# EAGLE design RPI-CM4-Breakout (EAGLE 9.6.2)

## Sheet 1 of 4
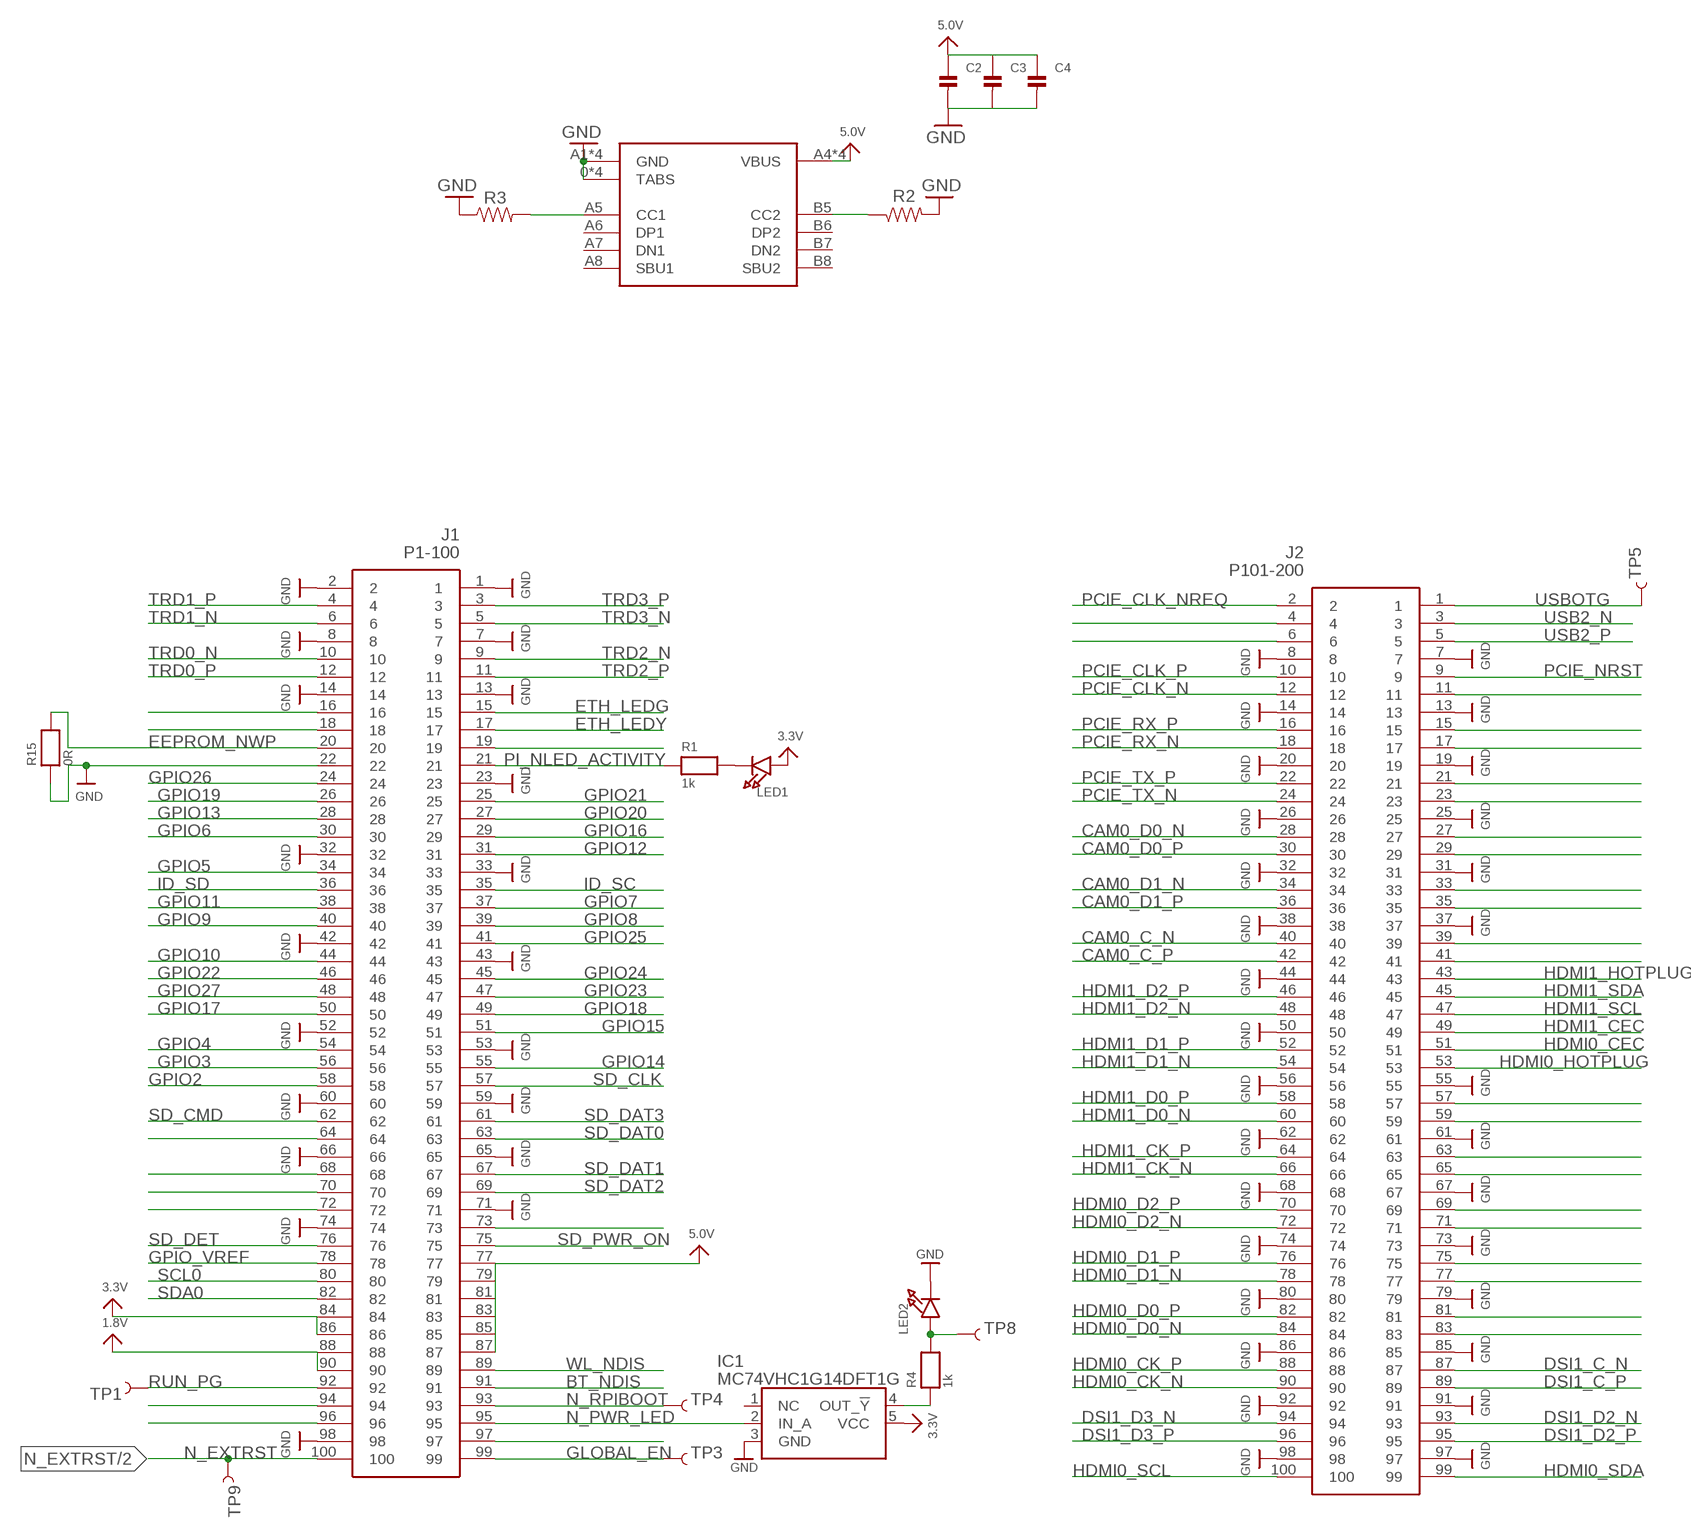
[diagram p0: schematic, sheet 1]

### Parts
C2  CAP_CERAMIC0402  [0402]
C3  CAP_CERAMIC0402  [0402]
C4  CAP_CERAMIC0402  [0402]
IC1  MC74VHC1G14DFT1G  [SOT65P210X110-5N]
J1  P1-100  DF40C-100DS-0.4V_51_  [DF40C100DS04V51]
J2  P101-200  DF40C-100DS-0.4V_51_  [DF40C100DS04V51]
LED1  LED0603  [CHIPLED_0603]
LED2  LED0603  [CHIPLED_0603]
R1  1k  RESISTOR_0402MP  [_0402MP]
R2  RESISTOR0603  [0603]
R3  RESISTOR0603  [0603]
R4  1k  RESISTOR_0402MP  [_0402MP]
R15  0R  RESISTOR_0402MP  [_0402MP]
TP1  TEST-POINT3X5  [PAD.03X.05]
TP3  TEST-POINT3X5  [PAD.03X.05]
TP4  TEST-POINT3X5  [PAD.03X.05]
TP5  TEST-POINT3X5  [PAD.03X.05]
TP8  TEST-POINT3X5  [PAD.03X.05]
TP9  TEST-POINT3X5  [PAD.03X.05]
U$59  TYPE-C-31-M-12  [USB-TYPE-C_16PIN-MALE-TYPE-C-31-M-12]

### Nets
1.8V [VCC]: J1.88 J1.90
3.3V [VCC]: IC1.5(VCC) J1.84 J1.86 LED1.A ; also sheet 2,3,4
5.0V [VCC]: C2.1 C3.1 C4.1 J1.77 J1.79 J1.81 J1.83 J1.85 J1.87 U$59.A4(VBUS) U$59.A9(VBUS) U$59.B4(VBUS) U$59.B9(VBUS) ; also sheet 2,4
A0/CC2: R3.2 U$59.A5(CC1)
A3/CC1: R2.1 U$59.B5(CC2)
BT_NDIS: J1.91
CAM0_C_N: J2.40
CAM0_C_P: J2.42
CAM0_D0_N: J2.28
CAM0_D0_P: J2.30
CAM0_D1_N: J2.34
CAM0_D1_P: J2.36
DSI1_C_N: J2.87
DSI1_C_P: J2.89
DSI1_D2_N: J2.93
DSI1_D2_P: J2.95
DSI1_D3_N: J2.94
DSI1_D3_P: J2.96
EEPROM_NWP: J1.20 R15.2
ETH_LEDG: J1.15 ; also sheet 3
ETH_LEDY: J1.17 ; also sheet 3
GLOBAL_EN: J1.99 TP3.P$1
GND [GND]: C2.2 C3.2 C4.2 IC1.3(GND) J1.1 J1.2 J1.7 J1.8 J1.13 J1.14 J1.22 J1.23 J1.32 J1.33 J1.42 J1.43 J1.52 J1.53 J1.59 J1.60 J1.65 J1.66 J1.71 J1.74 J1.98 J2.7 J2.8 J2.13 J2.14 J2.19 J2.20 J2.25 J2.26 J2.31 J2.32 J2.37 J2.38 J2.44 J2.50 J2.55 J2.56 J2.61 J2.62 J2.67 J2.68 J2.73 J2.74 J2.79 J2.80 J2.85 J2.86 J2.91 J2.92 J2.97 J2.98 LED2.C R2.2 R3.1 R15.1 U$59.0(TABS) U$59.0-1(TABS) U$59.0-2(TABS) U$59.0-3(TABS) U$59.A1(GND) U$59.A12(GND) U$59.B1(GND) U$59.B12(GND) ; also sheet 2,3,4
GPIO2: J1.58
GPIO3: J1.56
GPIO4: J1.54
GPIO5: J1.34
GPIO6: J1.30
GPIO7: J1.37
GPIO8: J1.39
GPIO9: J1.40
GPIO10: J1.44
GPIO11: J1.38
GPIO12: J1.31
GPIO13: J1.28
GPIO14: J1.55
GPIO15: J1.51
GPIO16: J1.29
GPIO17: J1.50
GPIO18: J1.49
GPIO19: J1.26
GPIO20: J1.27
GPIO21: J1.25
GPIO22: J1.46
GPIO23: J1.47
GPIO24: J1.45
GPIO25: J1.41
GPIO26: J1.24
GPIO27: J1.48
GPIO_VREF: J1.78
HDMI0_CEC: J2.51
HDMI0_CK_N: J2.90 ; also sheet 4
HDMI0_CK_P: J2.88 ; also sheet 4
HDMI0_D0_N: J2.84 ; also sheet 4
HDMI0_D0_P: J2.82 ; also sheet 4
HDMI0_D1_N: J2.78 ; also sheet 4
HDMI0_D1_P: J2.76 ; also sheet 4
HDMI0_D2_N: J2.72 ; also sheet 4
HDMI0_D2_P: J2.70 ; also sheet 4
HDMI0_HOTPLUG: J2.53 ; also sheet 4
HDMI0_SCL: J2.100 ; also sheet 4
HDMI0_SDA: J2.99 ; also sheet 4
HDMI1_CEC: J2.49
HDMI1_CK_N: J2.66
HDMI1_CK_P: J2.64
HDMI1_D0_N: J2.60
HDMI1_D0_P: J2.58
HDMI1_D1_N: J2.54
HDMI1_D1_P: J2.52
HDMI1_D2_N: J2.48
HDMI1_D2_P: J2.46
HDMI1_HOTPLUG: J2.43
HDMI1_SCL: J2.47
HDMI1_SDA: J2.45
ID_SC: J1.35
ID_SD: J1.36
N$1: LED1.C R1.2
N$4: IC1.4(OUT_!Y) R4.1
N$5: J2.4
N$6: LED2.A R4.2 TP8.P$1
N$7: J2.6
N$12: J2.11
N$16: J1.16
N$17: J2.15
N$18: J1.18
N$19: J1.19
N$21: J2.17
N$32: J2.21
N$42: J2.23
N$57: J2.27
N$59: J2.29
N$63: J2.33
N$64: J1.64
N$66: J2.35
N$68: J1.68
N$70: J1.70
N$72: J1.72
N$73: J1.73
N$74: J2.39
N$76: J2.41
N$94: J1.94
N$96: J1.96
N$97: J1.97
N$99: J2.57
N$101: J2.59
N$105: J2.63
N$107: J2.65
N$111: J2.69
N$113: J2.71
N$117: J2.75
N$119: J2.77
N$123: J2.81
N$125: J2.83
N_EXTRST: J1.100 TP9.P$1 ; also sheet 2
N_PWR_LED: IC1.2(IN_A) J1.95
N_RPIBOOT: J1.93 TP4.P$1
PCIE_CLK_N: J2.12
PCIE_CLK_NREQ: J2.2
PCIE_CLK_P: J2.10
PCIE_NRST: J2.9
PCIE_RX_N: J2.18
PCIE_RX_P: J2.16
PCIE_TX_N: J2.24
PCIE_TX_P: J2.22
PI_NLED_ACTIVITY: J1.21 R1.1
RUN_PG: J1.92 TP1.P$1
SCL0: J1.80
SD_CLK: J1.57 ; also sheet 4
SD_CMD: J1.62 ; also sheet 4
SD_DAT0: J1.63 ; also sheet 4
SD_DAT1: J1.67 ; also sheet 4
SD_DAT2: J1.69 ; also sheet 4
SD_DAT3: J1.61 ; also sheet 4
SD_DET: J1.76
SD_PWR_ON: J1.75
SDA0: J1.82
TRD0_N: J1.10 ; also sheet 3
TRD0_P: J1.12 ; also sheet 3
TRD1_N: J1.6 ; also sheet 3
TRD1_P: J1.4 ; also sheet 3
TRD2_N: J1.9 ; also sheet 3
TRD2_P: J1.11 ; also sheet 3
TRD3_N: J1.5 ; also sheet 3
TRD3_P: J1.3 ; also sheet 3
USB2_N: J2.3 ; also sheet 2
USB2_P: J2.5 ; also sheet 2
USBOTG: J2.1 TP5.P$1 ; also sheet 2
WL_NDIS: J1.89
Unconnected: IC1.1(NC) U$59.A6(DP1) U$59.A7(DN1) U$59.A8(SBU1) U$59.B6(DP2) U$59.B7(DN2) U$59.B8(SBU2)

## Sheet 2 of 4: USB Connectors
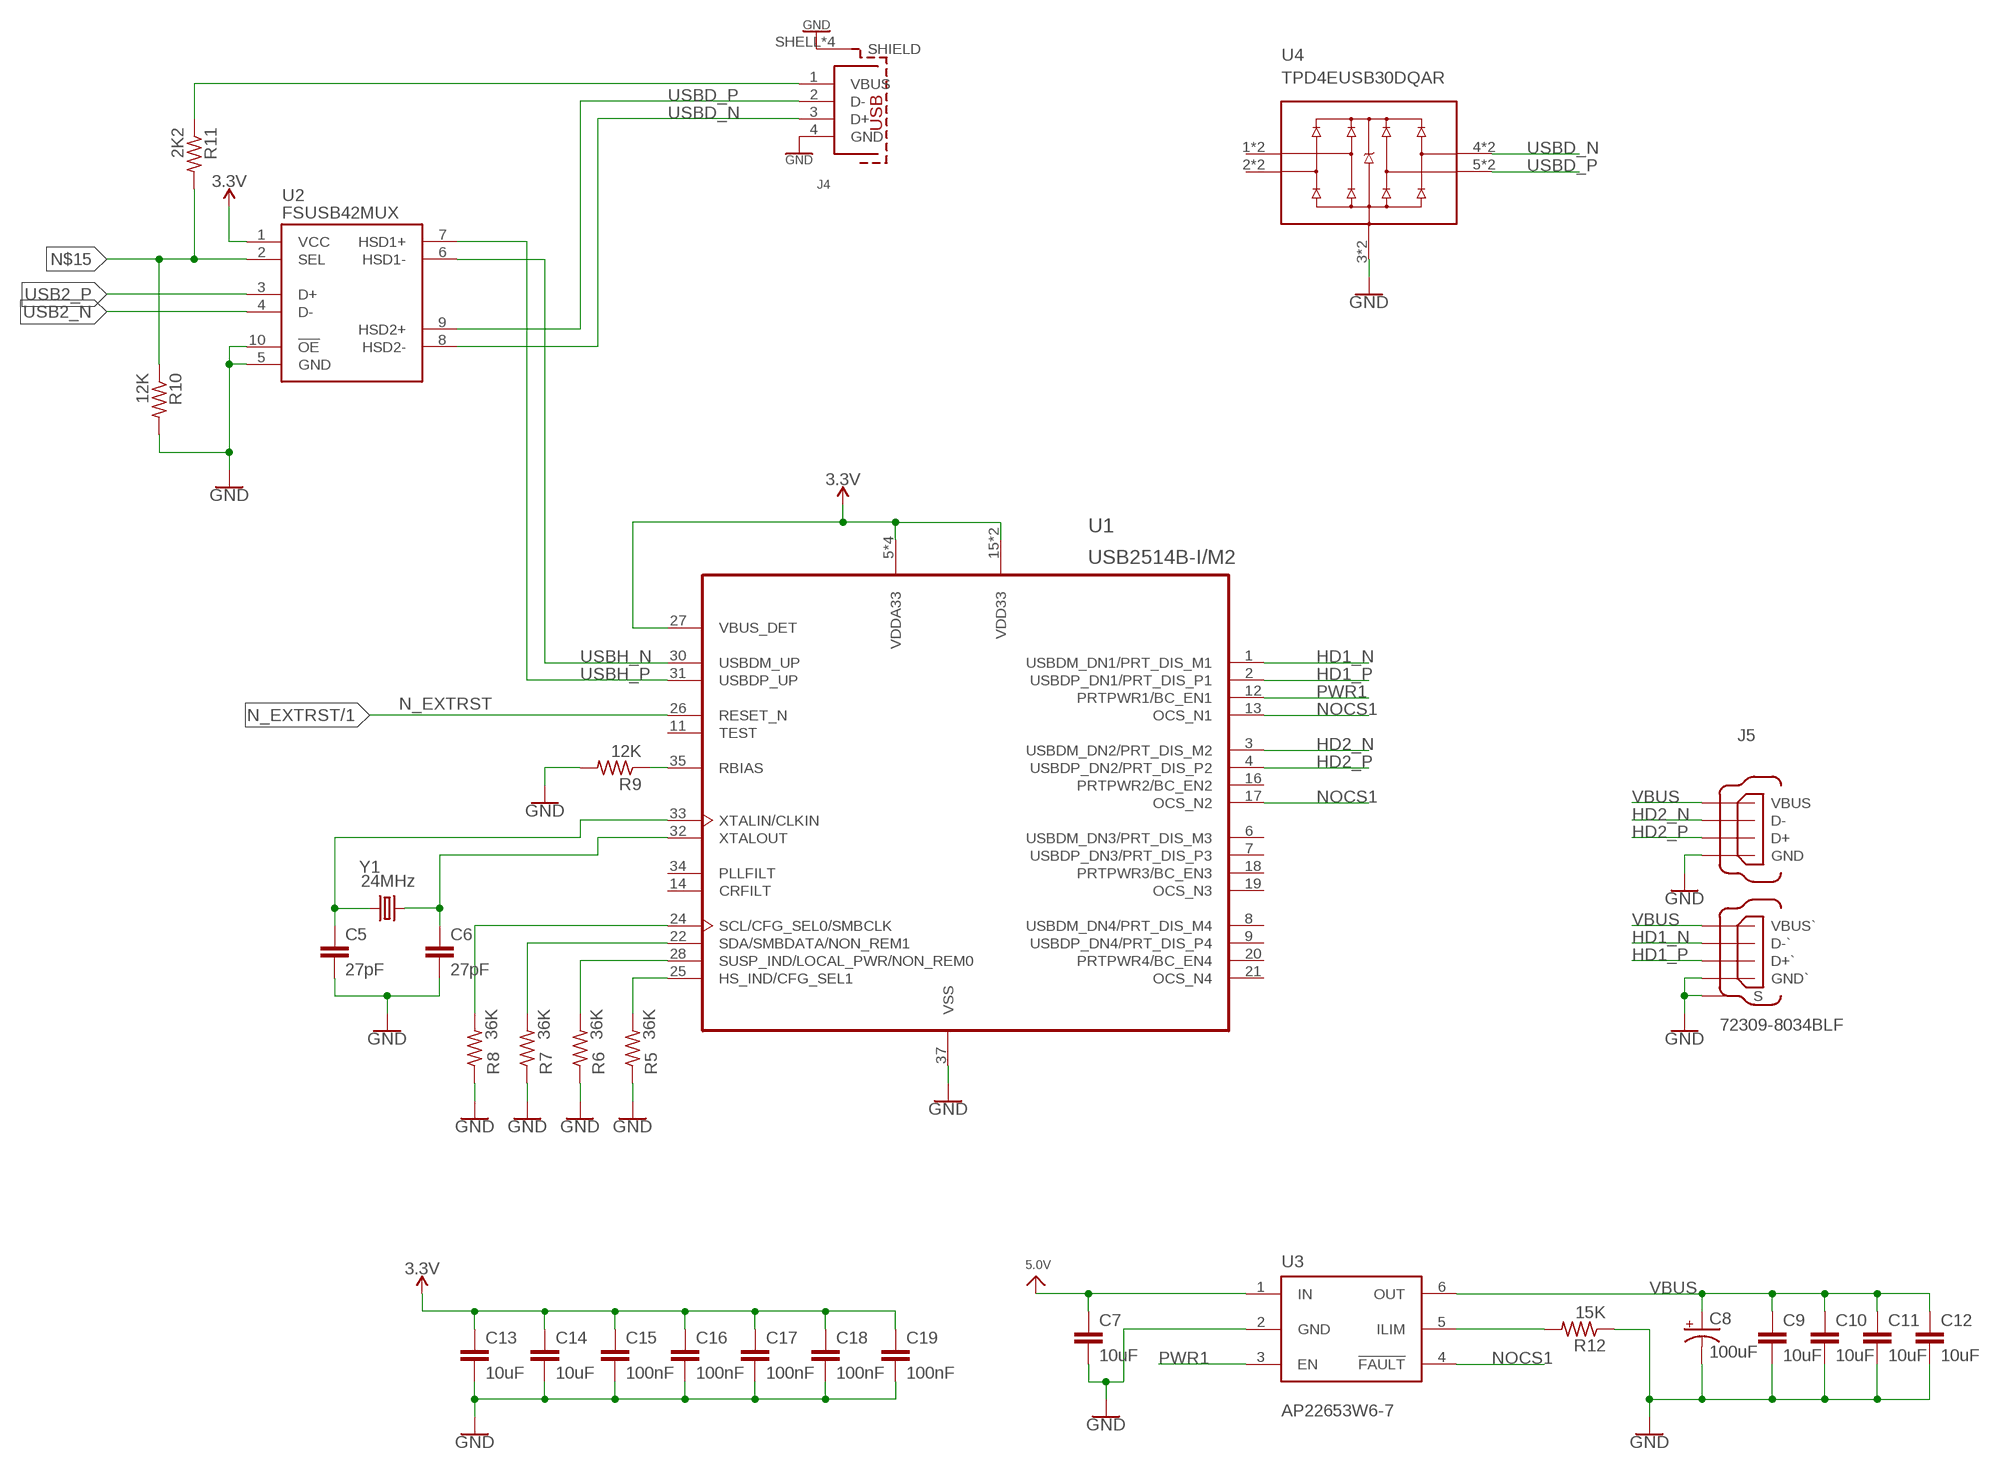
[diagram p1: schematic, sheet 2]

### Parts
C5  27pF  C-EUC0603  [C0603]
C6  27pF  C-EUC0603  [C0603]
C7  10uF  C-EUC0805  [C0805]
C8  100uF  100UF-POLAR-EIA7343-16V-10%(TANT)  [EIA7343]
C9  10uF  C-EUC0805  [C0805]
C10  10uF  C-EUC0805  [C0805]
C11  10uF  C-EUC0805  [C0805]
C12  10uF  C-EUC0805  [C0805]
C13  10uF  C-EUC0805  [C0805]
C14  10uF  C-EUC0805  [C0805]
C15  100nF  C-EUC0603  [C0603]
C16  100nF  C-EUC0603  [C0603]
C17  100nF  C-EUC0603  [C0603]
C18  100nF  C-EUC0603  [C0603]
C19  100nF  C-EUC0603  [C0603]
J4  629104190121  [629104190121]
J5  72309-8034BLF  [FRAMATOME_72309-8034BLF]
R5  36K  R-US_R0603  [R0603]
R6  36K  R-US_R0603  [R0603]
R7  36K  R-US_R0603  [R0603]
R8  36K  R-US_R0603  [R0603]
R9  12K  R-US_R0603  [R0603]
R10  12K  R-US_R0603  [R0603]
R11  2K2  R-US_R0603  [R0603]
R12  15K  R-US_R0603  [R0603]
U1  USB2514B-I/M2  [QFN50P600X600X100-37N]
U2  FSUSB42MUX  [SOP50P490X110-10N]
U3  AP22653W6-7  [SOT95P280X145-6N]
U4  TPD4EUSB30DQAR  [IC_TPD4EUSB30DQAR]
Y1  24MHz  CRYSTALSM49  [SM49]

### Nets
3.3V [VCC]: C13.1 C14.1 C15.1 C16.1 C17.1 C18.1 C19.1 U1.5(VDDA33) U1.10(VDDA33) U1.15(VDD33) U1.23(VDD33) U1.27(VBUS_DET) U1.29(VDDA33) U1.36(VDDA33) U2.1(VCC) ; also sheet 1,3,4
5.0V [VCC]: C7.1 U3.1(IN) ; also sheet 1,4
GND [GND]: C5.2 C6.2 C7.2 C8.C(-) C9.2 C10.2 C11.2 C12.2 C13.2 C14.2 C15.2 C16.2 C17.2 C18.2 C19.2 J4.4(GND) J4.SHELL1(SHIELD) J4.SHELL2(SHIELD) J4.SHELL3(SHIELD) J4.SHELL(SHIELD) J5.1(S) J5.2(S) J5.A4(GND`) J5.B4(GND) R5.1 R6.1 R7.1 R8.1 R9.2 R10.2 R12.1 U1.37(VSS) U2.5(GND) U2.10(!OE) U3.2(GND) U4.3(GND_3) U4.8(GND_3) ; also sheet 1,3,4
HD1_N: J5.A2(D-`) U1.1(USBDM_DN1/PRT_DIS_M1)
HD1_P: J5.A3(D+`) U1.2(USBDP_DN1/PRT_DIS_P1)
HD2_N: J5.B2(D-) U1.3(USBDM_DN2/PRT_DIS_M2)
HD2_P: J5.B3(D+) U1.4(USBDP_DN2/PRT_DIS_P2)
N$3: R5.2 U1.25(HS_IND/CFG_SEL1)
N$8: R6.2 U1.28(SUSP_IND/LOCAL_PWR/NON_REM0)
N$9: R7.2 U1.22(SDA/SMBDATA/NON_REM1)
N$10: R8.2 U1.24(SCL/CFG_SEL0/SMBCLK)
N$11: R9.1 U1.35(RBIAS)
N$13: C5.1 U1.33(XTALIN/CLKIN) Y1.1
N$14: C6.1 U1.32(XTALOUT) Y1.2
N$15: R10.1 R11.2 U2.2(SEL)
N$20: R12.2 U3.5(ILIM)
N_EXTRST: U1.26(RESET_N) ; also sheet 1
NOCS1: U1.13(OCS_N1) U1.17(OCS_N2) U3.4(!FAULT)
PWR1 [VCC]: U1.12(PRTPWR1/BC_EN1) U3.3(EN)
USB2_N: U2.4(D-) ; also sheet 1
USB2_P: U2.3(D+) ; also sheet 1
USBD_N: J4.3(D+) U2.8(HSD2-) U4.4(D2+) U4.7(D2+)
USBD_P: J4.2(D-) U2.9(HSD2+) U4.5(D2-) U4.6(D2-)
USBH_N: U1.30(USBDM_UP) U2.6(HSD1-)
USBH_P: U1.31(USBDP_UP) U2.7(HSD1+)
USBOTG: J4.1(VBUS) R11.1 ; also sheet 1
VBUS [VCC]: C8.A(+) C9.1 C10.1 C11.1 C12.1 J5.A1(VBUS`) J5.B1(VBUS) U3.6(OUT) ; also sheet 1
Unconnected: U1.6(USBDM_DN3/PRT_DIS_M3) U1.7(USBDP_DN3/PRT_DIS_P3) U1.8(USBDM_DN4/PRT_DIS_M4) U1.9(USBDP_DN4/PRT_DIS_P4) U1.11(TEST) U1.14(CRFILT) U1.16(PRTPWR2/BC_EN2) U1.18(PRTPWR3/BC_EN3) U1.19(OCS_N3) U1.20(PRTPWR4/BC_EN4) U1.21(OCS_N4) U1.34(PLLFILT) U4.1(D1+) U4.2(D1-) U4.9(D1-) U4.10(D1+)

## Sheet 3 of 4: Ethernet
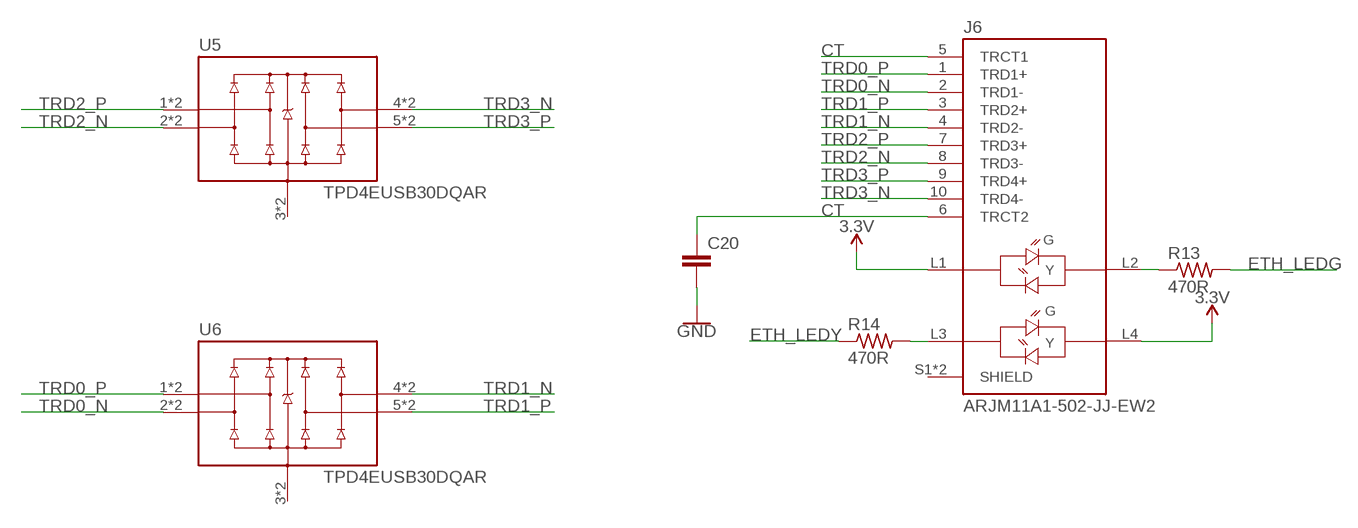
[diagram p2: schematic, sheet 3]

### Parts
C20  C-EUC0603  [C0603]
J6  ARJM11A1-502-JJ-EW2  [ABRACON_ARJM11A1-502-JJ-EW2]
R13  470R  R-US_R0603  [R0603]
R14  470R  R-US_R0603  [R0603]
U5  TPD4EUSB30DQAR  [IC_TPD4EUSB30DQAR]
U6  TPD4EUSB30DQAR  [IC_TPD4EUSB30DQAR]

### Nets
3.3V [VCC]: J6.L1 J6.L4 ; also sheet 1,2,4
CT: C20.1 J6.5(TRCT1) J6.6(TRCT2)
ETH_LEDG: R13.2 ; also sheet 1
ETH_LEDY: R14.1 ; also sheet 1
GND [GND]: C20.2 ; also sheet 1,2,4
N$22: J6.L2 R13.1
N$23: J6.L3 R14.2
TRD0_N: J6.2(TRD1-) U6.2(D1-) U6.9(D1-) ; also sheet 1
TRD0_P: J6.1(TRD1+) U6.1(D1+) U6.10(D1+) ; also sheet 1
TRD1_N: J6.4(TRD2-) U6.4(D2+) U6.7(D2+) ; also sheet 1
TRD1_P: J6.3(TRD2+) U6.5(D2-) U6.6(D2-) ; also sheet 1
TRD2_N: J6.8(TRD3-) U5.2(D1-) U5.9(D1-) ; also sheet 1
TRD2_P: J6.7(TRD3+) U5.1(D1+) U5.10(D1+) ; also sheet 1
TRD3_N: J6.10(TRD4-) U5.4(D2+) U5.7(D2+) ; also sheet 1
TRD3_P: J6.9(TRD4+) U5.5(D2-) U5.6(D2-) ; also sheet 1
Unconnected: J6.S1(SHIELD) J6.S2(SHIELD)

## Sheet 4 of 4: SD Card and HDMI
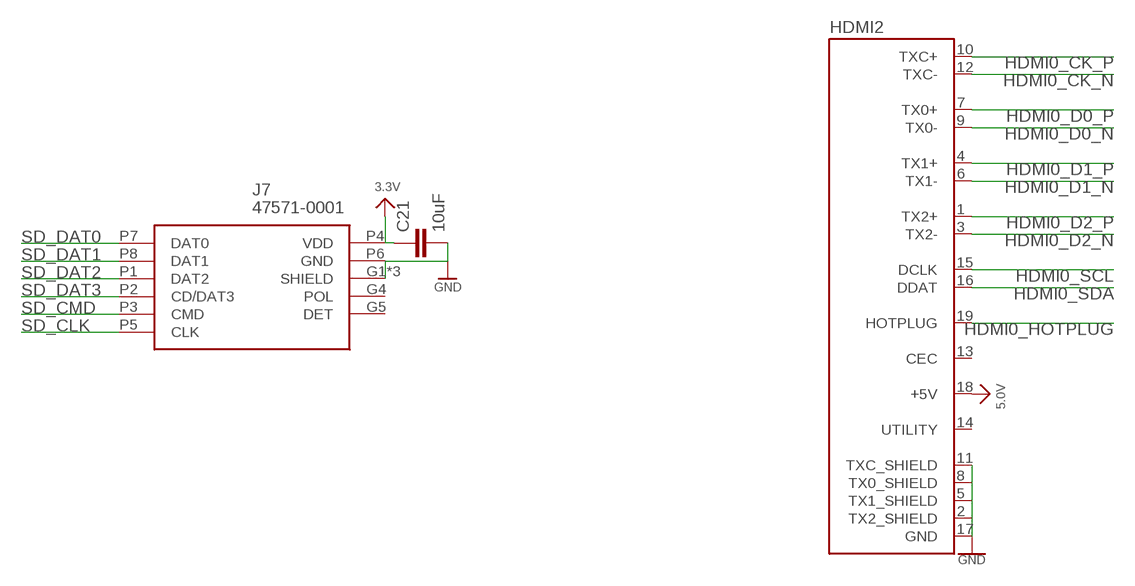
[diagram p3: schematic, sheet 4]

### Parts
C21  10uF  10UF-0603-6.3V-20%  [0603]
HDMI2  HDMI_MOLEX_47151-0001  [HDMI_MOLEX_47151-0001]
J7  47571-0001  [47571-0001]

### Nets
3.3V [VCC]: C21.1 J7.P4(VDD) ; also sheet 1,2,3
5.0V [VCC]: HDMI2.18(+5V) ; also sheet 1,2
GND [GND]: C21.2 HDMI2.2(TX2_SHIELD) HDMI2.5(TX1_SHIELD) HDMI2.8(TX0_SHIELD) HDMI2.11(TXC_SHIELD) HDMI2.17(GND) J7.G1(SHIELD) J7.G2(SHIELD) J7.G3(SHIELD) J7.P6(GND) ; also sheet 1,2,3
HDMI0_CK_N: HDMI2.12(TXC-) ; also sheet 1
HDMI0_CK_P: HDMI2.10(TXC+) ; also sheet 1
HDMI0_D0_N: HDMI2.9(TX0-) ; also sheet 1
HDMI0_D0_P: HDMI2.7(TX0+) ; also sheet 1
HDMI0_D1_N: HDMI2.6(TX1-) ; also sheet 1
HDMI0_D1_P: HDMI2.4(TX1+) ; also sheet 1
HDMI0_D2_N: HDMI2.3(TX2-) ; also sheet 1
HDMI0_D2_P: HDMI2.1(TX2+) ; also sheet 1
HDMI0_HOTPLUG: HDMI2.19(HOTPLUG) ; also sheet 1
HDMI0_SCL: HDMI2.15(DCLK) ; also sheet 1
HDMI0_SDA: HDMI2.16(DDAT) ; also sheet 1
SD_CLK: J7.P5(CLK) ; also sheet 1
SD_CMD: J7.P3(CMD) ; also sheet 1
SD_DAT0: J7.P7(DAT0) ; also sheet 1
SD_DAT1: J7.P8(DAT1) ; also sheet 1
SD_DAT2: J7.P1(DAT2) ; also sheet 1
SD_DAT3: J7.P2(CD/DAT3) ; also sheet 1
Unconnected: HDMI2.13(CEC) HDMI2.14(UTILITY) J7.G4(POL) J7.G5(DET)

## Power pins joined to a net without a drawn wire
GND: HDMI2.P$1(GND) HDMI2.P$2(GND) HDMI2.P$3(GND) HDMI2.P$4(GND)
GND_3: U5.3(GND_3) U5.8(GND_3) U6.3(GND_3) U6.8(GND_3)

## Library data of the parts
C2-C4 = microbuilder:CAP_CERAMIC: Ceramic Capacitors 0402 - 0402 Surface Mount Capacitors 16pF 50V 5% [Digikey: 445-4899-2-ND] 18pF 50V 5% [Digikey: 490-1281-2-ND] 22pF 50V 5% [Digikey: 490-1283-2-ND] 68pF 50V 5% [Digikey: 490-1289-2-ND] 0.1uF 10V 10% [Digikey: 490-1318-2-ND] 1.0uF 6.3V 10% [Digikey: 490-1320-2-ND] 0603 - 0603 Surface Mount Capacitors 16 pF 50V 5% [Digikey: 445-5051-2-ND] 22 pF 50V [Digikey: PCC220ACVTR-ND] 33 pF 50V 5% [Digikey: 490-1415-1-ND] 56pF 50V 5% [Digikey: 490-1421-1-ND] 220pF 50V 5% [Digikey: 445-1285-1-ND] 680 pF 50V 2200 pF 50V 5% C0G [Digikey: 445-1297-1-ND] 5600 pF 100V 5% X7R [Digikey: 478-3711-1-ND] 0.1 µF 25V 10% [Digikey: PCC2277TR-ND] 0.22 µF 16V 10% X7R [Digikey: 445-1318-1-ND] 1.0 µF 25V 10% [Digikey: 445-5146-2-ND] 0603 - RF Specific 3pF 250V +/-0.1pF RF [Digikey: 712-1347-1-ND] 18 pF 250V 5% [Digikey: 478-3505-1-ND or 712-1322-1-ND] 56 pF 250V 5% C0G RF [Digikey: 490-4867-1-ND] 68 pF 250V RF [Digikey: 490-4868-1-ND] 0805 - 0805 Surface Mount Capacitors 220 pF 250V 2% RF Ceramic Capacitor [Digikey: 712-1398-1-ND] 1000 pF 50V 2% NP0 Ceramic Capacitor [Digikey: 478-3760-1-ND] 0.1 µF 25V 10% Ceramic Capacitor [Digikey: PCC1828TR-ND] 1.0 µF 16V 10% Ceramic Capacitor[Digikey: 490-1691-2-ND] 10.0 µF 10V 10% Ceramic Capacitor[Digikey: 709-1228-1-ND] 10.0 uF 16V 10% Ceramic Capacitor [Digikey: 478-5165-2-ND] 47 uF 6.3V 20% Ceramic Capacitor [Digikey: 587-1779-1-ND or 399-5506-1-ND] 1206 - 1206 Surface Mount Capacitors 47uF 10V 20% Ceramic Capacitor [Digikey: 490-5528-1-ND or 399-5508-1-ND or 445-6010-1-ND] 100uF 6.3V -20%, +80% Y5V Ceramic Capacitor (Digikey: 490-4512-1-ND, Mouser: 81-GRM31CF50J107ZE1L)
C5-C7 C9-C20 = rcl:C-EU: CAPACITOR, European symbol; SPICEPREFIX: C
C8 = SparkFun-Capacitors:100UF-POLAR: 100µF polarized capacitors A capacitor is a passive two-terminal electrical component used to store electrical energy temporarily in an electric field.; PROD_ID: CAP-08702
C21 = SparkFun-Capacitors:10UF: 10.0µF ceramic capacitors A capacitor is a passive two-terminal electrical component used to store electrical energy temporarily in an electric field.; PROD_ID: CAP-11015
HDMI2 = microbuilder:HDMI_MOLEX_47151-0001
IC1 = SamacSys_Parts:MC74VHC1G14DFT1G: Source: Datasheet <http://www.onsemi.com/pub/Collateral/MC74VHC1G14-D.PDF>; HEIGHT: 1.1mm; MANUFACTURER_NAME: ON Semiconductor; MANUFACTURER_PART_NUMBER: MC74VHC1G14DFT1G; MOUSER_PART_NUMBER: 863-MC74VHC1G14DFT1G; MOUSER_PRICE-STOCK: https://www.mouser.co.uk/ProductDetail/ON-Semiconductor/MC74VHC1G14DFT1G?qs=YOLdObVcOZkl2BbCxsVnXA%3D%3D
J1 J2 = SamacSys_Parts:DF40C-100DS-0.4V_51_: HIROSE(HRS) - DF40C-100DS-0.4V(51) - CONNECTOR, STACKING, RCPT, 100POS, 2ROW Source: Datasheet <https://www.hirose.com/product/en/download_file/key_name/DF40C-100DS-0.4V(51)/category/Drawing (2D)/doc_file_id/46856/?file_category_id=6&item_id=06844033451&is_series=>; DESCRIPTION: HIROSE(HRS) - DF40C-100DS-0.4V(51) - CONNECTOR, STACKING, RCPT, 100POS, 2ROW; HEIGHT: 1.65mm; MANUFACTURER_NAME: Hirose; MANUFACTURER_PART_NUMBER: DF40C-100DS-0.4V(51); MOUSER_PART_NUMBER: 798-DF40C100DS0.4V51; MOUSER_PRICE-STOCK: https://www.mouser.co.uk/ProductDetail/Hirose-Connector/DF40C-100DS-04V51?qs=eDUdFcBPps2MEwbnuPvZzQ%3D%3D
J4 = EAGLE-INPUT_OUTPUT_CONNECTORS-rev17a:629104190121: USB 2.0 Type A Horizontal SMT Short Type WR-COM_629104190121 <http://katalog.we-online.de/media/images/v2/Family_WR-COM_629104190121.jpg> Details see: http://katalog.we-online.de/en/em/COM_2_0_SMT_TYPE_A_HORIZONTAL_SHORT_TYPE/629104190121 Created bY Yingchun,Shan 2016 (C) Würth Elektronik
J5 = 72309-8034BLF:72309-8034BLF: Conn; Data; USB; TypeA; Socket; 8Cnts; RightAngle; ThruHole; White; 1.57mmPCB Check prices <https://pricing.snapeda.com/parts/72309-8034BLF/Amphenol%20ICC/view-part?ref=eda>; AVAILABILITY: In Stock; DESCRIPTION: USB-A (USB TYPE-A), Stacked USB 2.0 Receptacle Connector 8 Position Through Hole, Right Angle; MF: Amphenol ICC; MP: 72309-8034BLF; PACKAGE: D2PAK STMicroelectronics; PRICE: None; PURCHASE-URL: https://pricing.snapeda.com/search/part/72309-8034BLF/?ref=eda
J6 = ARJM11A1-502-JJ-EW2:ARJM11A1-502-JJ-EW2: 1 Port RJ45 Magjack Connector Through Hole 10/100/1000 Base-T, AutoMDIX Check prices <https://pricing.snapeda.com/parts/ARJM11A1-502-JJ-EW2/Abracon%20LLC/view-part?ref=eda>; AVAILABILITY: In Stock; DESCRIPTION: 1 Port RJ45 Magjack Connector Through Hole 10/100/1000 Base-T, AutoMDIX; MF: Abracon LLC; MP: ARJM11A1-502-JJ-EW2; PACKAGE: None; PRICE: None; PURCHASE-URL: https://pricing.snapeda.com/search/part/ARJM11A1-502-JJ-EW2/?ref=eda
J7 = SamacSys_Parts:47571-0001: Memory Card Connectors ASSY FOR TFR HEADER HEADER W/DETECT PIN Source: Datasheet <https://componentsearchengine.com/Datasheets/1/47571-0001.pdf>; DESCRIPTION: Memory Card Connectors ASSY FOR TFR HEADER HEADER W/DETECT PIN; HEIGHT: mm; MANUFACTURER_NAME: Molex; MANUFACTURER_PART_NUMBER: 47571-0001; MOUSER_PART_NUMBER: 538-47571-0001; MOUSER_PRICE-STOCK: https://www.mouser.com/Search/Refine.aspx?Keyword=538-47571-0001
LED1 LED2 = microbuilder:LED: LED 0603 - 0603 Surface Mount Package 2mA: Green LED - Low Power (3.9mcd, 2ma, 1.7Vf) - Digikey: 475-2709-2-ND Orange LED - Low Power (9.8mcd, 2ma, 1.8Vf) - Digikey: 475-1194-2-ND Red LED - Low Power (5mcd, 2ma, 1.8Vf) - Digikey: 475-1195-2-ND Yellow LED - Low Power (7mcd, 2ma, 1.8Vf) - Digikey: 475-1196-2-ND 5mA: Blue LED - Low Power (17mcd, 5ma, 2.9Vf) - Digikey: LNJ937W8CRACT-ND 0805 - 0805 Surface Mount Package 2mA: Red LED (8.8mcd, 2mA, 1.8Vf, Clear) - Low Power [Digikey: 475-2510-1-ND] Green LED (5mcd, 2mA, 1.8Vf, Clear) - Low Power [Digikey: 475-2730-1-ND] Yellow LED (11.3mcd, 2mA, 1.8Vf, Clear) - Low Power [Digikey: 475-2555-1-ND] 20mA: Red LED (104mcd, 20mA, Diffused) - LS R976 [Digikey: 475-1278-6-ND] Red LED (12mcd, 20mA, 2.0Vf, Clear) - APT2012EC [Digikey: 754-1128-1-ND] Green LED (15mcd, 20mA, 2.2Vf, Clear) - APT2012GC [Digikey: 754-1131-1-ND] Orange LED (160mcd, 20mA, 2.1Vf, Clear) - APT2012SECK [Digikey: 754-1130-1-ND] 1206 - 1206 Surface Mount Package Green LED (26mcd, 20mA, Diffused) - LG N971 [Digikey: 475-1407-6-ND] Red LED (15mcd, 20mA, Diffused) - LH N974 [Digikey: 475-1416-6-ND]
R1 R4 R15 = microbuilder:RESISTOR: Resistors 0402 - 0402 Surface Mount Package 22 Ohm 1% 1/16W [Digikey: 311-22.0LRTR-ND] 33 Ohm 5% 1/16W 1.0K 5% 1/16W 1.5K 5% 1/16W 2.0K 1% 1/16W 10.0K 1% 1/16W [Digikey: 311-10.0KLRTR-ND] 10.0K 5% 1/16W [Digikey: RMCF0402JT10K0TR-ND] 12.1K 1% 1/16W [Digikey: 311-22.0LRTR-ND] 100.0K 5% 1/16W 0603 - 0603 Surface Mount Package 0 Ohm 1/10 Watt 1% Resistor 15 Ohm 1/10 Watt 1% Resistor 33 Ohm 1/10 Watt 1% Resistor 49.9 Ohm 1/10 Watt 1% Resistor 100 Ohm 1/10 Watt 1% Resistor 150 Ohm 1/10 Watt 1% Resistor 240 Ohm 1/10 Watt 1% Resistor 390 Ohm 1/10 Watt 1% Resistor 560 Ohm 1/10 Watt 1% Resistor 680 Ohm 1/10 Watt 1% Resistor 750 Ohm 1/10 Watt 1% Resistor 1.0K Ohm 1/10 Watt 1% Resistor 1.5K Ohm 1/10 Watt 1% Resistor 2.0K Ohm 1/10 Watt 1% Resistor 2.2K Ohm 1/10 Watt 1% Resistor 3.3K Ohm 1/10 Watt 1% Resistor 4.7K Ohm 1/10 Watt 1% Resistor 10.0K Ohm 1/10 Watt 1% Resistor 12.0K Ohm 1/10 Watt 1% Resistor 12.1K Ohm 1/10 Watt 1% Resistor 20.0K Ohm 1/10 Watt 1% Resistor 33.0K Ohm 1/10 Watt 1% Resistor 100.0K Ohm 1/10 Watt 1% Resistor 0805 - 0805 Surface Mount Package 0 Ohm 1/8 Watt 1% Resistor 33 Ohm 1/8 Watt 1% Resistor 100 Ohm 1/8 Watt 1% Resistor 150 Ohm 1/8 Watt 1% Resistor 200 Ohm 1/8 Watt 1% Resistor 240 Ohm 1/8 Watt 1% Resistor 330 Ohm 1/8 Watt 1% Resistor 390 Ohm 1/8 Watt 1% Resistor 470 Ohm 1/8 Watt 1% Resistor 1.0K Ohm 1/8 Watt 1% Resistor 1.5K Ohm 1/8 Watt 1% Resistor 2.0K Ohm 1/8 Watt 1% Resistor 4.7K Ohm 1/8 Watt 1% Resistor 5.1K Ohm 1/8 Watt 1% Resistor 5.6K Ohm 1/8 Watt 1% Resistor 10.0K Ohm 1/8 Watt 1% Resistor 22.0K Ohm 1/8 Watt 1% Resistor 33.0K Ohm 1/8 Watt 1% Resistor 100K Ohm 1/8 Watt 1% Resistor 1206 - 1206 Surface Mount Package 2012 - 2010 Surface Mount Package 0.11 Ohm 1/2 Watt 1% Resistor - Digikey: RHM.11UCT-ND
R2 R3 = SparkFun-Resistors:RESISTOR: Generic Resistor Package
R5-R14 = rcl:R-US_: RESISTOR, American symbol; SPICEPREFIX: R
TP1 TP3-TP5 TP8 TP9 = SparkFun-Connectors:TEST-POINT: SparkFun Test Points Bare copper test points for troubleshooting or In-Circuit-Testing. These are used by our Production team for verifying production board runs using pogo-pins on test beds. SparkFun Products: SparkFun LSM9DS1 Breakout <https://www.sparkfun.com/products/13284> SparkFun PSOC <https://www.sparkfun.com/products/13714> SparkFun Load Cell Amplifier <https://www.sparkfun.com/products/13879>
U1 = USB2514B-I_M2:USB2514B-I/M2: None Check prices <https://pricing.snapeda.com/parts/USB2514B-I/M2/Microchip%20Technology/view-part?ref=eda>; AVAILABILITY: In Stock; DESCRIPTION: USB Hub Controller USB Interface 36-SQFN (6x6); MF: Microchip Technology; MP: USB2514B-I/M2; PACKAGE: VFQFN-36 Microchip Technology; PRICE: None; PURCHASE-URL: https://pricing.snapeda.com/search/part/USB2514B-I/M2/?ref=eda
U2 = FSUSB42MUX:FSUSB42MUX: Low Power, Two port, High speed, USB 2.0(480Mbps) UART switch MSOP-10 Check prices <https://pricing.snapeda.com/parts/FSUSB42MUX/ON%20Semiconductor/view-part?ref=eda>; AVAILABILITY: In Stock; DESCRIPTION: USB Switch IC 1 Channel 10-MSOP; MF: ON Semiconductor; MP: FSUSB42MUX; PACKAGE: MSOP-10 ON Semiconductor; PRICE: None; PURCHASE-URL: https://pricing.snapeda.com/search/part/FSUSB42MUX/?ref=eda
U3 = AP22653W6-7:AP22653W6-7: Power Switch/Driver 1:1 P-Channel 2.1A SOT-23-6 Check prices <https://pricing.snapeda.com/parts/AP22653W6-7/Diodes%20Incorporated/view-part?ref=eda>; AVAILABILITY: In Stock; DESCRIPTION: Power Switch/Driver 1:1 P-Channel 2.1A SOT-23-6; MF: Diodes Incorporated; MP: AP22653W6-7; PACKAGE: SOT-23-6 Diodes Incorporated; PRICE: None; PURCHASE-URL: https://pricing.snapeda.com/search/part/AP22653W6-7/?ref=eda
U4-U6 = TPD4EUSB30DQAR:TPD4EUSB30DQAR: 4-channel ESD solution for SuperSpeed (6 Gbps) USB 3.0 interface 10-USON -40 to 85 Check prices <https://pricing.snapeda.com/parts/TPD4EUSB30DQAR/Texas%20Instruments/view-part?ref=eda>; AVAILABILITY: In Stock; DESCRIPTION: 4-channel ESD solution for SuperSpeed (6 Gbps) USB 3.0 interface 10-USON -40 to 85; MF: Texas Instruments; MP: TPD4EUSB30DQAR; PACKAGE: USON-10 Texas Instruments; PRICE: None; PURCHASE-URL: https://pricing.snapeda.com/search/part/TPD4EUSB30DQAR/?ref=eda
U$59 = Custom-Parts:TYPE-C-31-M-12
Y1 = crystal:CRYSTAL: CRYSTAL; OC_FARNELL: unknown; OC_NEWARK: unknown

## Net classes
0 default: drill 0.008 mm
2 GND: width 0.508 mm

## Board
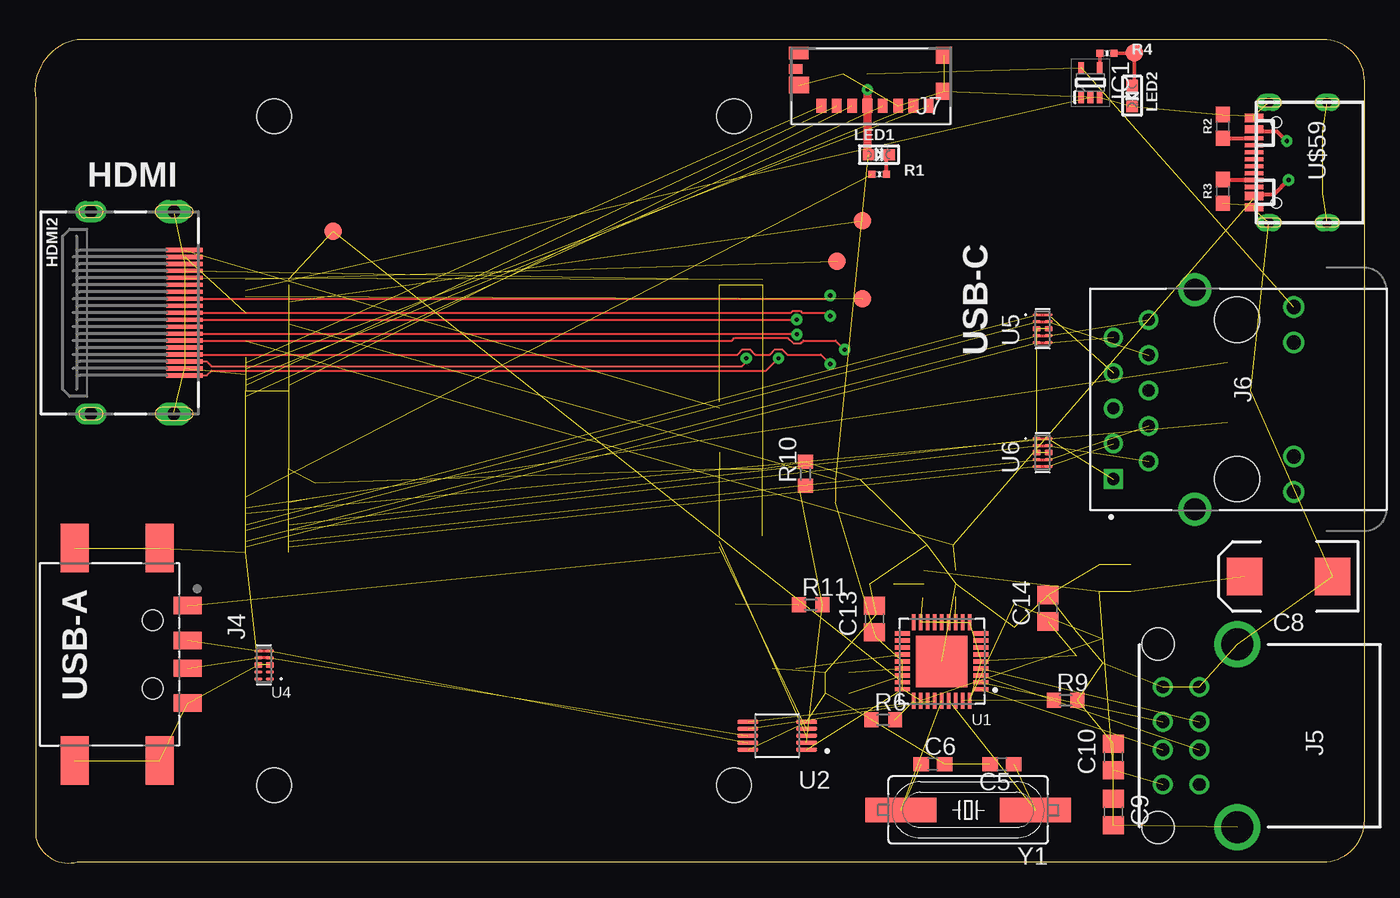
[diagram p4: board, top side]
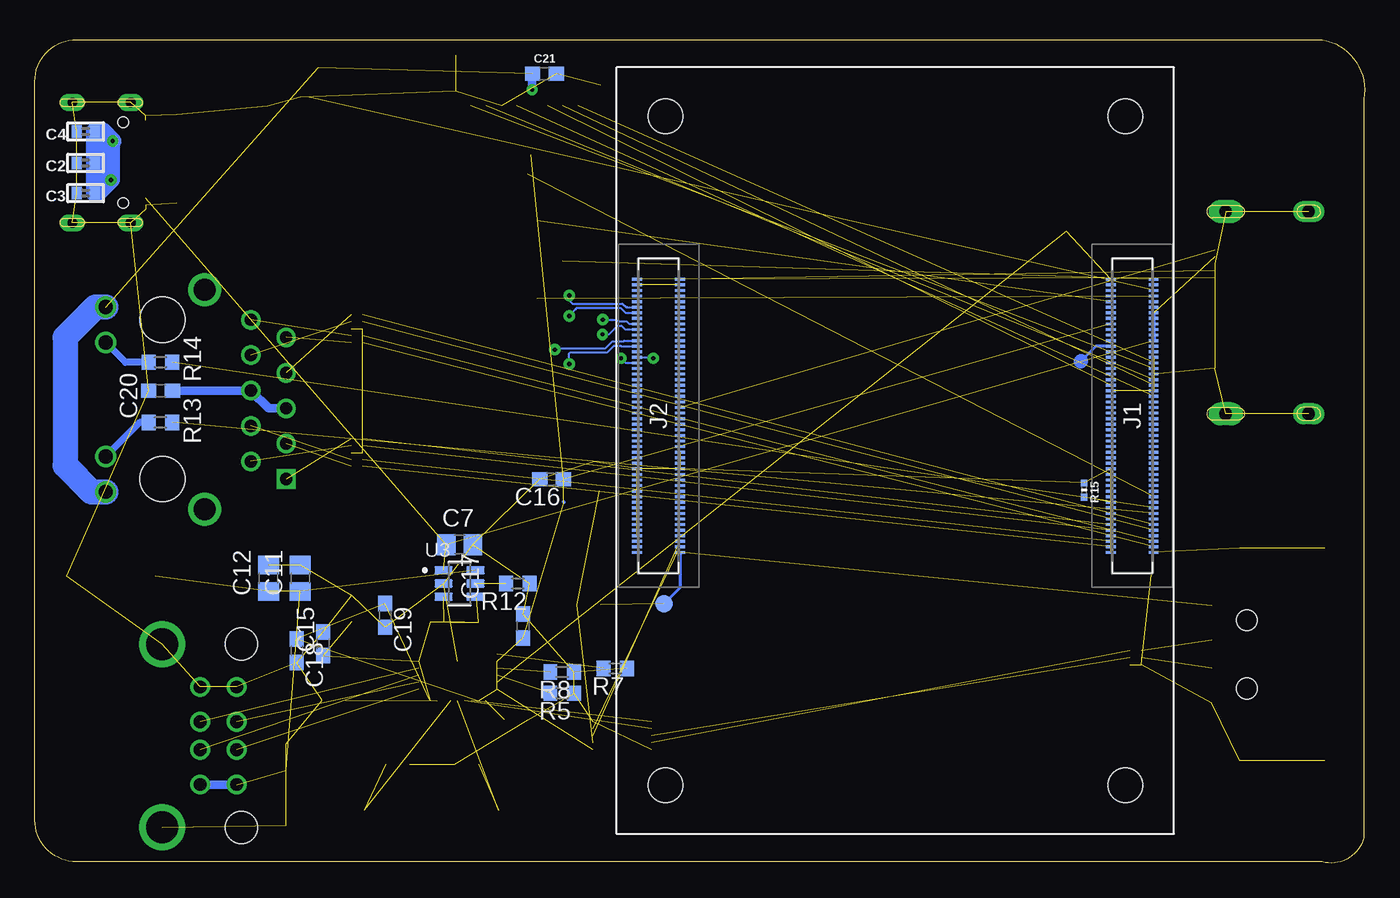
[diagram p5: board, bottom side, seen from below]

Size 95.45 x 59.08 mm. Coordinates in mm from the lower left corner, seen from the top.
Outline: 92.45,59.08 3.05,59.08 arc90 0.05,54.81 0.05,1.81 arc90 3.05,0.08 92.45,0.08 arc90 95.45,3.08 95.45,56.08 arc90 92.45,59.08
Copper layers (1*16): Top 0.035mm / dielectric 1.5mm / Bottom 0.035mm
Design rules "OthermillDRC_30_deg_v2 *": minimum track width 6mil, minimum drill 0.8mm, track to track 6mil, track to pad 6mil, pad to pad 6mil, via to via 6mil, smd to smd 0mil, copper to edge 0mil, drill to drill 3mil, minimum pad ring 10mil, minimum via ring 10mil, stop-mask expansion 1mil, vias tented up to drill 30mil, thermal gap 6mil
Holes 2.5 mm at 50.18,53.58 17.18,53.58 50.18,5.58 17.18,5.58

### Footprints (pad centres in the part's own frame; a part is rotated, then mirrored left to right if it is on the bottom)
0402 = smd 0.7 x 0.9: 1 -0.65,0; 2 0.65,0
C0603 = smd 1.1 x 1: 1 -0.85,0; 2 0.85,0
C0805 = smd 1.3 x 1.5: 1 -0.95,0; 2 0.95,0
EIA7343 = smd 2.55 x 2.7: A 3.17,0; C -3.17,0
0603 = smd 1.1 x 1: 1 -0.85,0; 2 0.85,0
HDMI_MOLEX_47151-0001 = smd 0.3 x 2.6: 1 4.5,0; 2 4,0; 3 3.5,0; 4 3,0; 5 2.5,0; 6 2,0; 7 1.5,0; 8 1,0; 9 0.5,0; 10 0,0; 11 -0.5,0; 12 -1,0; 13 -1.5,0; 14 -2,0; 15 -2.5,0; 16 -3,0; 17 -3.5,0; 18 -4,0; 19 -4.5,0 | drill 0.9 pad 1.65 long: P$1 -7.25,-0.76; P$2 7.25,-0.76 | drill 0.9 pad 1.5 long: P$3 7.25,-6.72; P$4 -7.25,-6.72
SOT65P210X110-5N = smd 0.85 x 0.4: 1 -1.05,0.65; 2 -1.05,0; 3 -1.05,-0.65; 4 1.05,-0.65; 5 1.05,0.65
DF40C100DS04V51 = smd 0.2 x 0.7: 1 -9.8,-1.54; 2 -9.8,1.54; 3 -9.4,-1.54; 4 -9.4,1.54; 5 -9,-1.54; 6 -9,1.54; 7 -8.6,-1.54; 8 -8.6,1.54; 9 -8.2,-1.54; 10 -8.2,1.54; 11 -7.8,-1.54; 12 -7.8,1.54; 13 -7.4,-1.54; 14 -7.4,1.54; 15 -7,-1.54; 16 -7,1.54; 17 -6.6,-1.54; 18 -6.6,1.54; 19 -6.2,-1.54; 20 -6.2,1.54; 21 -5.8,-1.54; 22 -5.8,1.54; 23 -5.4,-1.54; 24 -5.4,1.54; 25 -5,-1.54; 26 -5,1.54; 27 -4.6,-1.54; 28 -4.6,1.54; 29 -4.2,-1.54; 30 -4.2,1.54; 31 -3.8,-1.54; 32 -3.8,1.54; 33 -3.4,-1.54; 34 -3.4,1.54; 35 -3,-1.54; 36 -3,1.54; 37 -2.6,-1.54; 38 -2.6,1.54; 39 -2.2,-1.54; 40 -2.2,1.54; 41 -1.8,-1.54; 42 -1.8,1.54; 43 -1.4,-1.54; 44 -1.4,1.54; 45 -1,-1.54; 46 -1,1.54; 47 -0.6,-1.54; 48 -0.6,1.54; 49 -0.2,-1.54; 50 -0.2,1.54; 51 0.2,-1.54; 52 0.2,1.54; 53 0.6,-1.54; 54 0.6,1.54; 55 1,-1.54; 56 1,1.54; 57 1.4,-1.54; 58 1.4,1.54; 59 1.8,-1.54; 60 1.8,1.54; 61 2.2,-1.54; 62 2.2,1.54; 63 2.6,-1.54; 64 2.6,1.54; 65 3,-1.54; 66 3,1.54; 67 3.4,-1.54; 68 3.4,1.54; 69 3.8,-1.54; 70 3.8,1.54; 71 4.2,-1.54; 72 4.2,1.54; 73 4.6,-1.54; 74 4.6,1.54; 75 5,-1.54; 76 5,1.54; 77 5.4,-1.54; 78 5.4,1.54; 79 5.8,-1.54; 80 5.8,1.54; 81 6.2,-1.54; 82 6.2,1.54; 83 6.6,-1.54; 84 6.6,1.54; 85 7,-1.54; 86 7,1.54; 87 7.4,-1.54; 88 7.4,1.54; 89 7.8,-1.54; 90 7.8,1.54; 91 8.2,-1.54; 92 8.2,1.54; 93 8.6,-1.54; 94 8.6,1.54; 95 9,-1.54; 96 9,1.54; 97 9.4,-1.54; 98 9.4,1.54; 99 9.8,-1.54; 100 9.8,1.54
629104190121 = smd 1.25 x 2: 1 -3.5,2; 2 -1,2; 3 1,2; 4 3.5,2 | smd 3.5 x 2: SHELL -7.625,0; SHELL1 7.625,0; SHELL2 -7.625,-6.1; SHELL3 7.625,-6.1 | hole 1.5: -2.45,-0.5; 2.45,-0.5
FRAMATOME_72309-8034BLF = drill 2.3: 1 -6.57,0; 2 6.57,0 | drill 0.92: A1 -3.5,5.33; A2 -1,5.33; A3 1,5.33; A4 3.5,5.33; B1 -3.5,2.71; B2 -1,2.71; B3 1,2.71; B4 3.5,2.71 | hole 2.3: -6.57,5.68; 6.57,5.68
ABRACON_ARJM11A1-502-JJ-EW2 = drill 0.89 square: 1 -5.715,8.89 | drill 0.89: 2 -4.445,6.35; 3 -3.175,8.89; 4 -1.905,6.35; 5 -0.635,8.89; 6 0.635,6.35; 7 1.905,8.89; 8 3.175,6.35; 9 4.445,8.89; 10 5.715,6.35 | drill 1.02: L1 -6.63,-4.06; L2 -4.09,-4.06; L3 4.09,-4.06; L4 6.63,-4.06 | drill 1.57: S1 -7.875,3.05; S2 7.875,3.05 | hole 3.25: -5.715,0; 5.715,0
47571-0001 = smd 1.15 x 1.2: G1 -5.225,0.365; G2 -5.225,-2.225 | smd 1.45 x 1.2: G3 5.175,-0.075 | smd 1 x 0.7: G4 5.4,-1.225 | smd 1.4 x 0.9: G5 5.2,-2.375 | smd 0.7 x 1: P1 3.55,1.415; P2 2.45,1.415; P3 1.35,1.415; P4 0.25,1.415; P5 -0.85,1.415; P6 -1.95,1.415; P7 -3.05,1.415; P8 -4.15,1.415
CHIPLED_0603 = smd 0.8 x 0.8: A 0,-0.75; C 0,0.75
_0402MP = smd 0.5 x 0.5: 1 -0.508,0; 2 0.508,0
R0603 = smd 1 x 1.1: 1 -0.85,0; 2 0.85,0
PAD.03X.05 = smd 1.27 x 1.27: P$1 0,0
QFN50P600X600X100-37N = smd 1.1 x 0.26: 1 -2.815,2; 2 -2.815,1.5; 3 -2.815,1; 4 -2.815,0.5; 5 -2.815,0; 6 -2.815,-0.5; 7 -2.815,-1; 8 -2.815,-1.5; 9 -2.815,-2; 19 2.815,-2; 20 2.815,-1.5; 21 2.815,-1; 22 2.815,-0.5; 23 2.815,0; 24 2.815,0.5; 25 2.815,1; 26 2.815,1.5; 27 2.815,2 | smd 0.26 x 1.1: 10 -2,-2.815; 11 -1.5,-2.815; 12 -1,-2.815; 13 -0.5,-2.815; 14 0,-2.815; 15 0.5,-2.815; 16 1,-2.815; 17 1.5,-2.815; 18 2,-2.815; 28 2,2.815; 29 1.5,2.815; 30 1,2.815; 31 0.5,2.815; 32 0,2.815; 33 -0.5,2.815; 34 -1,2.815; 35 -1.5,2.815; 36 -2,2.815 | smd 3.7 x 3.7: 37 0,0
SOP50P490X110-10N = smd 1.5 x 0.28: 1 -2.105,1; 2 -2.105,0.5; 3 -2.105,0; 4 -2.105,-0.5; 5 -2.105,-1; 6 2.105,-1; 7 2.105,-0.5; 8 2.105,0; 9 2.105,0.5; 10 2.105,1
SOT95P280X145-6N = smd 1.32 x 0.59: 1 -1.145,0.95; 2 -1.145,0; 3 -1.145,-0.95; 4 1.145,-0.95; 5 1.145,0; 6 1.145,0.95
IC_TPD4EUSB30DQAR = smd 0.565 x 0.2: 1 -0.417,1; 2 -0.417,0.5; 4 -0.417,-0.5; 5 -0.417,-1; 6 0.417,-1; 7 0.417,-0.5; 9 0.417,0.5; 10 0.417,1 | smd 0.565 x 0.4: 3 -0.417,0; 8 0.417,0
USB-TYPE-C_16PIN-MALE-TYPE-C-31-M-12 = drill 0.7 pad 1.2 long: 0 -4.32,1.556; 0-1 4.32,1.556; 0-2 4.32,-2.624; 0-3 -4.32,-2.624 | smd 0.3 x 1.3: A1 -3.35,2.623; A4 -2.55,2.623; A5 -1.25,2.623; A6 -0.25,2.623; A7 0.25,2.623; A8 1.25,2.624; A9 2.55,2.623; A12 3.35,2.623; B1 3.05,2.623; B4 2.25,2.623; B5 1.75,2.623; B6 0.75,2.623; B7 -0.75,2.623; B8 -1.75,2.624; B9 -2.25,2.623; B12 -3.05,2.623 | hole 0.75: 2.89,1.026; -2.89,1.026
SM49 = smd 5.08 x 1.778: 1 -4.826,0; 2 4.826,0

### Placement (x,y rotation side)
C2  91.81,50.24 180 bottom
C3  91.81,48.07 180 bottom
C4  91.81,52.5 180 bottom
C5  69.41,7.1 180 top
C6  64.46,7.1 0 top
C7  64.97,22.85 0 bottom
C8  89.99,20.56 180 top
C9  77.41,3.67 270 top
C10  77.41,7.61 90 top
C11  76.4,20.44 90 bottom
C12  78.68,20.44 90 bottom
C13  60.27,17.52 90 top
C14  72.72,18.28 90 top
C15  74.75,15.74 90 bottom
C16  58.36,27.55 180 bottom
C17  60.4,17.01 90 bottom
C18  76.65,15.23 270 bottom
C19  70.3,17.77 270 bottom
C20  86.43,33.9 180 bottom
C21  58.87,56.63 0 bottom
HDMI2  10.74,39.49 270 top
IC1  75.76,56 90 top
J1  16.68,32.08 90 bottom
J2  50.68,32.08 90 bottom
J4  8.96,14.98 270 top
J5  86.3,9.13 90 top
J6  86.3,33.26 90 top
J7  60.02,55.74 180 top
LED1  60.58,50.83 270 top
LED2  78.76,55.04 180 top
R1  60.61,49.42 0 top
R2  85.27,52.85 90 top
R3  85.27,48.19 90 top
R4  76.96,58.11 0 top
R5  57.6,12.18 180 bottom
R6  60.9,10.28 0 top
R7  53.79,13.96 180 bottom
R8  57.6,13.71 180 bottom
R9  73.99,11.67 0 top
R10  55.32,27.93 90 top
R11  55.7,18.53 0 top
R12  60.78,20.06 180 bottom
R13  86.43,31.61 0 bottom
R14  86.43,35.93 180 bottom
R15  20.14,26.76 270 bottom
TP1  59.4,46.09 0 top
TP3  57.57,43.17 0 top
TP4  59.4,40.49 0 top
TP5  50.28,18.62 0 bottom
TP8  78.94,58.16 0 top
TP9  21.41,45.33 0 top
U1  65.1,14.47 180 top
U2  53.28,9.13 180 top
U3  64.97,20.06 0 bottom
U4  16.45,14.21 180 top
U5  72.33,38.34 0 top
U6  72.33,29.45 0 top
U$59  90.13,50.25 90 top
Y1  67,3.8 180 top

### Tracks (layer width: path | path; a pad name or v marks a point on that pad's centre or on a via)
1.8V  (1 unrouted)
3.3V  (via drill 0.3)  (19 unrouted)
  Top 0.61: v59.76,55.49 v59.77,55.48 J7.P4 59.77,50.89 LED1.A
  Bottom 0.152: J1.86 J1.84
  Bottom 0.254: 57.48,25.9 57.51,25.94
  Bottom 0.61: v59.76,55.49 59.76,56.34 C21.1
  Bottom 1.778: J6.L4 91.1,39.89 93.29,37.71 93.29,28.53 91.4,26.63 J6.L1
5.0V  (via drill 0.3 pad 0.55)  (4 unrouted)
  Top 0.305: v89.99,49.01 88.98,48 U$59.B9 U$59.A4 | v89.86,51.81 89.16,52.5 U$59.B4 U$59.A9
  Bottom 0.152: 15.14,39.36 J1.85 J1.83 J1.81 15.14,38.09
  Bottom 0.203: J1.77 15.14,37.58 | 15.14,39.36 J1.87
  Bottom 0.305: 15.14,39.36 J1.83 15.14,38.09 J1.79 15.14,37.58
  Bottom 0.61: C3.1 C2.1 C4.1
  Bottom 1.27: v89.99,49.01 89.99,51.68 v89.86,51.81 90.55,52.5 C4.1 C3.1 90.93,48.07 v89.99,49.01
A0/CC2
  Top 0.305: U$59.A5 85.31,49 R3.2
A3/CC1
  Top 0.305: R2.1 U$59.B5
CT
  Bottom 0.61: J6.5 78.68,32.63 J6.6 C20.1
EEPROM_NWP  (1 unrouted)
ETH_LEDG  (1 unrouted)
ETH_LEDY  (1 unrouted)
GLOBAL_EN  (1 unrouted)
GND  (118 unrouted)
GND_3  (3 unrouted)
HD1_N  (1 unrouted)
HD1_P  (1 unrouted)
HD2_N  (1 unrouted)
HD2_P  (1 unrouted)
HDMI0_CK_N  (via drill 0.3)
  Top 0.152: v57.09,40.72 56.86,40.49 HDMI2.12
  Bottom 0.152: v57.09,40.72 57.09,40.37 56.86,40.14 53.27,40.14 53,39.86 52.96,39.86 52.94,39.88 J2.90
HDMI0_CK_P  (via drill 0.3)
  Top 0.152: v57.09,39.26 56.86,39.49 55.08,39.49 54.94,39.62 54.42,39.62 54.28,39.49 HDMI2.10
  Bottom 0.152: J2.88 53.05,39.48 53.4,39.83 56.57,39.83 56.63,39.78 56.63,39.72 v57.09,39.26
HDMI0_D0_N  (via drill 0.3)
  Top 0.152: v54.68,38.99 HDMI2.9
  Bottom 0.152: J2.84 52.8,38.68 52.98,38.86 53.58,38.86 53.71,38.99 v54.68,38.99
HDMI0_D0_P  (via drill 0.3)
  Top 0.152: v54.71,37.93 54.65,37.99 HDMI2.7
  Bottom 0.152: J2.82 53.09,38.28 53.36,38.56 53.62,38.56 54.24,37.93 v54.71,37.93
HDMI0_D1_N  (via drill 0.3)
  Top 0.152: HDMI2.6 50.03,37.49 50.22,37.68 54.07,37.68 54.07,37.67 54.44,37.3 54.97,37.3 55.16,37.49 57.48,37.49 v58.13,36.84
  Bottom 0.152: J2.78 53.14,37.48 53.19,37.44 54,37.44 54.49,36.95 58.01,36.95 v58.13,36.84
HDMI0_D1_P  (via drill 0.3)
  Top 0.152: v57.09,35.8 56.41,36.49 54.01,36.49 53.64,36.85 53.12,36.85 52.75,36.49 51.7,36.49 51.33,36.85 50.81,36.85 50.44,36.49 HDMI2.4
  Bottom 0.152: J2.76 53.38,37.08 53.42,37.13 53.88,37.13 54.36,36.65 57.01,36.65 57.09,36.56 v57.09,35.8
HDMI0_D2_N  (via drill 0.3)
  Top 0.152: HDMI2.3 12.34,35.99 12.69,35.64 50.74,35.64 51.07,35.96 v51.07,36.22
  Bottom 0.152: J2.72 51.14,36.29 v51.07,36.22
HDMI0_D2_P  (via drill 0.3)
  Top 0.152: HDMI2.1 12.34,34.99 12.69,35.33 52.5,35.33 v53.38,36.22
  Bottom 0.152: J2.70 53.05,35.88 v53.38,36.22
HDMI0_HOTPLUG  (1 unrouted)
HDMI0_SCL  (1 unrouted)
HDMI0_SDA  (1 unrouted)
N$1
  Top 0.305: R1.2 61.12,50.62 LED1.C
N$3  (1 unrouted)
N$4
  Top 0.254: R4.1 76.45,57.08 IC1.4
N$6
  Top 0.254: R4.2 78.89,58.11 TP8.P$1 78.94,55.69 LED2.A
N$8  (1 unrouted)
N$9  (1 unrouted)
N$10  (1 unrouted)
N$11  (1 unrouted)
N$13  (2 unrouted)
N$14  (2 unrouted)
N$15  (2 unrouted)
  Top 0.203: 54.94,26.7 R10.1
N$20  (1 unrouted)
N$22
  Bottom 0.508: R13.1 87.93,31.61 J6.L2
N$23
  Bottom 0.508: R14.2 88.94,35.93 J6.L3
N_EXTRST  (2 unrouted)
N_PWR_LED  (1 unrouted)
N_RPIBOOT  (1 unrouted)
NOCS1  (2 unrouted)
  Bottom 0.254: 63.76,19.04 U3.4
PI_NLED_ACTIVITY  (1 unrouted)
  Bottom 0.152: J1.21 14.93,26.28
PWR1  (1 unrouted)
  Bottom 0.254: U3.3 66.17,19.17
RUN_PG  (1 unrouted)
SD_CLK  (1 unrouted)
SD_CMD  (1 unrouted)
SD_DAT0  (1 unrouted)
SD_DAT1  (1 unrouted)
SD_DAT2  (1 unrouted)
SD_DAT3  (1 unrouted)
SD_DET
  Bottom 0.203: J1.76 19.29,37.08 20.35,36.02
  Bottom 1.016: 20.39,35.98 20.35,36.02
TRD0_N  (2 unrouted)
  Top 0.203: U6.2 U6.9
TRD0_P  (2 unrouted)
  Top 0.203: U6.1 U6.10
TRD1_N  (2 unrouted)
  Top 0.203: U6.4 U6.7
TRD1_P  (2 unrouted)
  Top 0.203: U6.5 U6.6
TRD2_N  (2 unrouted)
  Top 0.203: U5.2 U5.9
TRD2_P  (2 unrouted)
  Top 0.203: U5.1 U5.10
TRD3_N  (2 unrouted)
  Top 0.203: U5.4 U5.7
TRD3_P  (2 unrouted)
  Top 0.203: U5.5 U5.6
USB2_N  (1 unrouted)
USB2_P  (1 unrouted)
USBD_N  (2 unrouted)
  Top 0.203: U4.4 U4.7
USBD_P  (2 unrouted)
  Top 0.203: U4.6 U4.5
USBH_N  (1 unrouted)
USBH_P  (1 unrouted)
USBOTG  (2 unrouted)
  Bottom 0.203: J2.1 49.14,19.76 TP5.P$1
VBUS  (6 unrouted)
  Bottom 0.61: J5.A1 J5.B1

### Text on the board
tNames: HDMI | USB-C | USB-A